# Altium schematic sheet Main.SchDoc
size A3; SheetNumber: 1; SheetTotal: 1
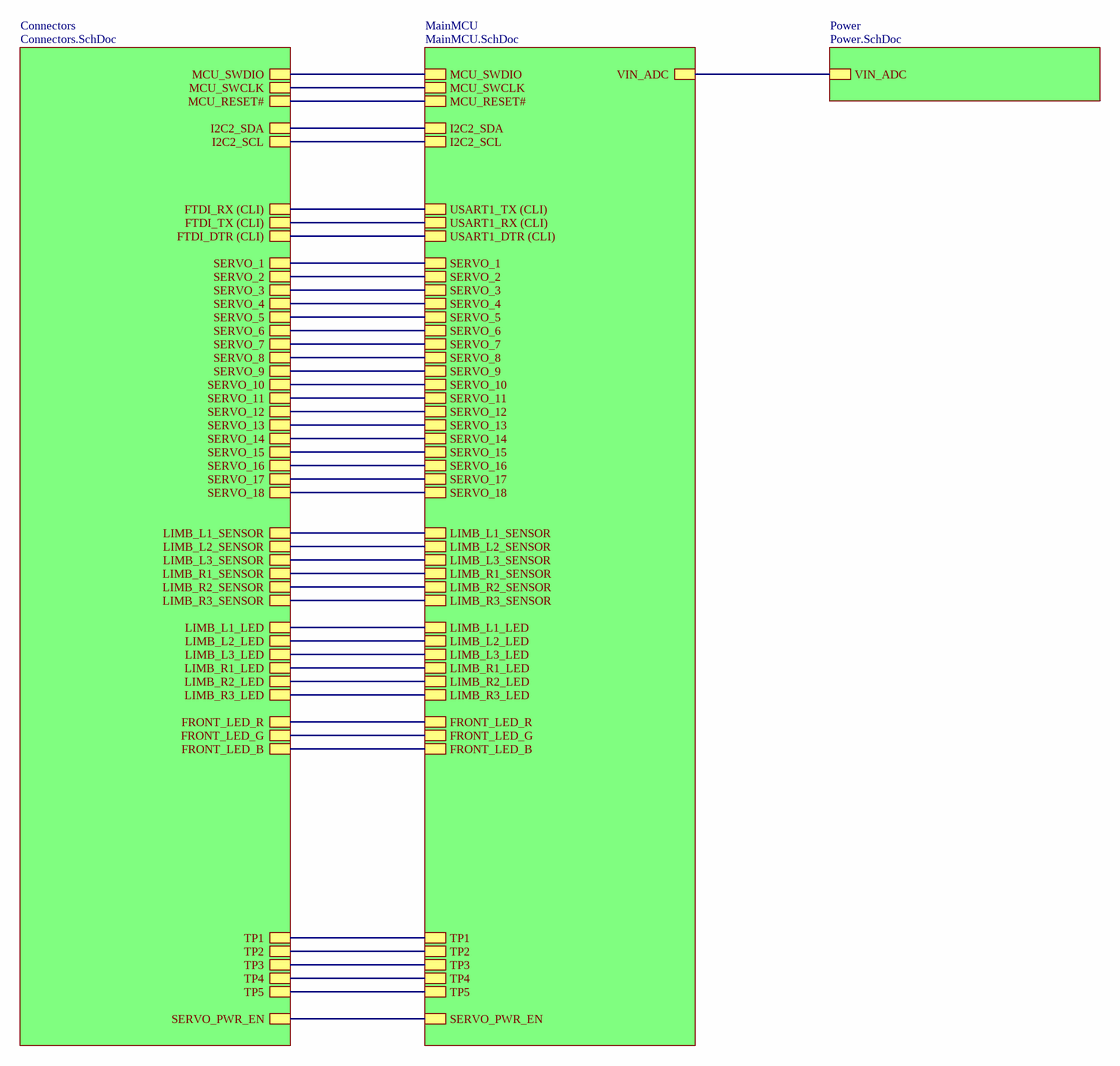
[diagram p0: Main.SchDoc]

## Sub-sheets
Connectors = Connectors.SchDoc: MCU_SWDIO, MCU_SWCLK, MCU_RESET#, FTDI_RX (CLI), FTDI_TX (CLI), SERVO_1, SERVO_2, SERVO_3, SERVO_4, SERVO_5, SERVO_6, SERVO_7, SERVO_8, SERVO_9, SERVO_10, SERVO_11, SERVO_12, SERVO_13, SERVO_14, SERVO_15, SERVO_16, SERVO_17, SERVO_18, SERVO_PWR_EN, I2C2_SDA, I2C2_SCL, FTDI_DTR (CLI), LIMB_L1_SENSOR, LIMB_L2_SENSOR, LIMB_L3_SENSOR, LIMB_R1_SENSOR, LIMB_R2_SENSOR, LIMB_R3_SENSOR, LIMB_L1_LED, LIMB_L2_LED, LIMB_L3_LED, LIMB_R1_LED, LIMB_R2_LED, LIMB_R3_LED, FRONT_LED_B, FRONT_LED_G, FRONT_LED_R, TP5, TP4, TP3, TP2, TP1
MainMCU = MainMCU.SchDoc: MCU_SWDIO, MCU_SWCLK, MCU_RESET#, USART1_TX (CLI), USART1_RX (CLI), VIN_ADC, SERVO_PWR_EN, I2C2_SDA, I2C2_SCL, USART1_DTR (CLI), SERVO_1, SERVO_2, SERVO_3, SERVO_4, SERVO_5, SERVO_6, SERVO_7, SERVO_8, SERVO_9, SERVO_10, SERVO_11, SERVO_12, SERVO_13, SERVO_14, SERVO_15, SERVO_16, SERVO_17, SERVO_18, LIMB_L1_SENSOR, LIMB_L2_SENSOR, LIMB_L3_SENSOR, LIMB_R1_SENSOR, LIMB_R2_SENSOR, LIMB_R3_SENSOR, FRONT_LED_R, FRONT_LED_G, FRONT_LED_B, TP5, TP4, TP3, TP2, TP1, LIMB_L1_LED, LIMB_L2_LED, LIMB_L3_LED, LIMB_R1_LED, LIMB_R2_LED, LIMB_R3_LED
Power = Power.SchDoc: VIN_ADC

## Nets
(unnamed): sheet Connectors/MCU_SWDIO, sheet MainMCU/MCU_SWDIO
(unnamed): sheet Connectors/MCU_SWCLK, sheet MainMCU/MCU_SWCLK
(unnamed): sheet Connectors/MCU_RESET#, sheet MainMCU/MCU_RESET#
(unnamed): sheet Connectors/FTDI_RX (CLI), sheet MainMCU/USART1_TX (CLI)
(unnamed): sheet Connectors/FTDI_TX (CLI), sheet MainMCU/USART1_RX (CLI)
(unnamed): sheet Connectors/SERVO_1, sheet MainMCU/SERVO_1
(unnamed): sheet Connectors/SERVO_2, sheet MainMCU/SERVO_2
(unnamed): sheet Connectors/SERVO_3, sheet MainMCU/SERVO_3
(unnamed): sheet Connectors/SERVO_4, sheet MainMCU/SERVO_4
(unnamed): sheet Connectors/SERVO_5, sheet MainMCU/SERVO_5
(unnamed): sheet Connectors/SERVO_6, sheet MainMCU/SERVO_6
(unnamed): sheet Connectors/SERVO_7, sheet MainMCU/SERVO_7
(unnamed): sheet Connectors/SERVO_8, sheet MainMCU/SERVO_8
(unnamed): sheet Connectors/SERVO_9, sheet MainMCU/SERVO_9
(unnamed): sheet Connectors/SERVO_10, sheet MainMCU/SERVO_10
(unnamed): sheet Connectors/SERVO_11, sheet MainMCU/SERVO_11
(unnamed): sheet Connectors/SERVO_12, sheet MainMCU/SERVO_12
(unnamed): sheet Connectors/SERVO_13, sheet MainMCU/SERVO_13
(unnamed): sheet Connectors/SERVO_14, sheet MainMCU/SERVO_14
(unnamed): sheet Connectors/SERVO_15, sheet MainMCU/SERVO_15
(unnamed): sheet Connectors/SERVO_16, sheet MainMCU/SERVO_16
(unnamed): sheet Connectors/SERVO_17, sheet MainMCU/SERVO_17
(unnamed): sheet Connectors/SERVO_18, sheet MainMCU/SERVO_18
(unnamed): sheet Connectors/SERVO_PWR_EN, sheet MainMCU/SERVO_PWR_EN
(unnamed): sheet Connectors/I2C2_SDA, sheet MainMCU/I2C2_SDA
(unnamed): sheet Connectors/I2C2_SCL, sheet MainMCU/I2C2_SCL
(unnamed): sheet Connectors/FTDI_DTR (CLI), sheet MainMCU/USART1_DTR (CLI)
(unnamed): sheet Connectors/LIMB_L1_SENSOR, sheet MainMCU/LIMB_L1_SENSOR
(unnamed): sheet Connectors/LIMB_L2_SENSOR, sheet MainMCU/LIMB_L2_SENSOR
(unnamed): sheet Connectors/LIMB_L3_SENSOR, sheet MainMCU/LIMB_L3_SENSOR
(unnamed): sheet Connectors/LIMB_R1_SENSOR, sheet MainMCU/LIMB_R1_SENSOR
(unnamed): sheet Connectors/LIMB_R2_SENSOR, sheet MainMCU/LIMB_R2_SENSOR
(unnamed): sheet Connectors/LIMB_R3_SENSOR, sheet MainMCU/LIMB_R3_SENSOR
(unnamed): sheet Connectors/LIMB_L1_LED, sheet MainMCU/LIMB_L1_LED
(unnamed): sheet Connectors/LIMB_L2_LED, sheet MainMCU/LIMB_L2_LED
(unnamed): sheet Connectors/LIMB_L3_LED, sheet MainMCU/LIMB_L3_LED
(unnamed): sheet Connectors/LIMB_R1_LED, sheet MainMCU/LIMB_R1_LED
(unnamed): sheet Connectors/LIMB_R2_LED, sheet MainMCU/LIMB_R2_LED
(unnamed): sheet Connectors/LIMB_R3_LED, sheet MainMCU/LIMB_R3_LED
(unnamed): sheet Connectors/FRONT_LED_B, sheet MainMCU/FRONT_LED_B
(unnamed): sheet Connectors/FRONT_LED_G, sheet MainMCU/FRONT_LED_G
(unnamed): sheet Connectors/FRONT_LED_R, sheet MainMCU/FRONT_LED_R
(unnamed): sheet Connectors/TP5, sheet MainMCU/TP5
(unnamed): sheet Connectors/TP4, sheet MainMCU/TP4
(unnamed): sheet Connectors/TP3, sheet MainMCU/TP3
(unnamed): sheet Connectors/TP2, sheet MainMCU/TP2
(unnamed): sheet Connectors/TP1, sheet MainMCU/TP1
(unnamed): sheet MainMCU/VIN_ADC, sheet Power/VIN_ADC